# Altium schematic sheet 5_POWER.schdoc.schdoc
size 431 x 309 mm; Symbol: Sheet-Symbol_A4; Device: Sheet-Symbol_A4; Company: 嘉立创EDA; Version: V1.0; Page Size: A4; @Project Name: ProDocument_LN_CTRL_V1; @Page Count: 5; @Update Date: 2026-01-05; @Create Date: 2026-01-05; @Schematic Name: Schematic1; @Page No: 5; @Page Name: POWER
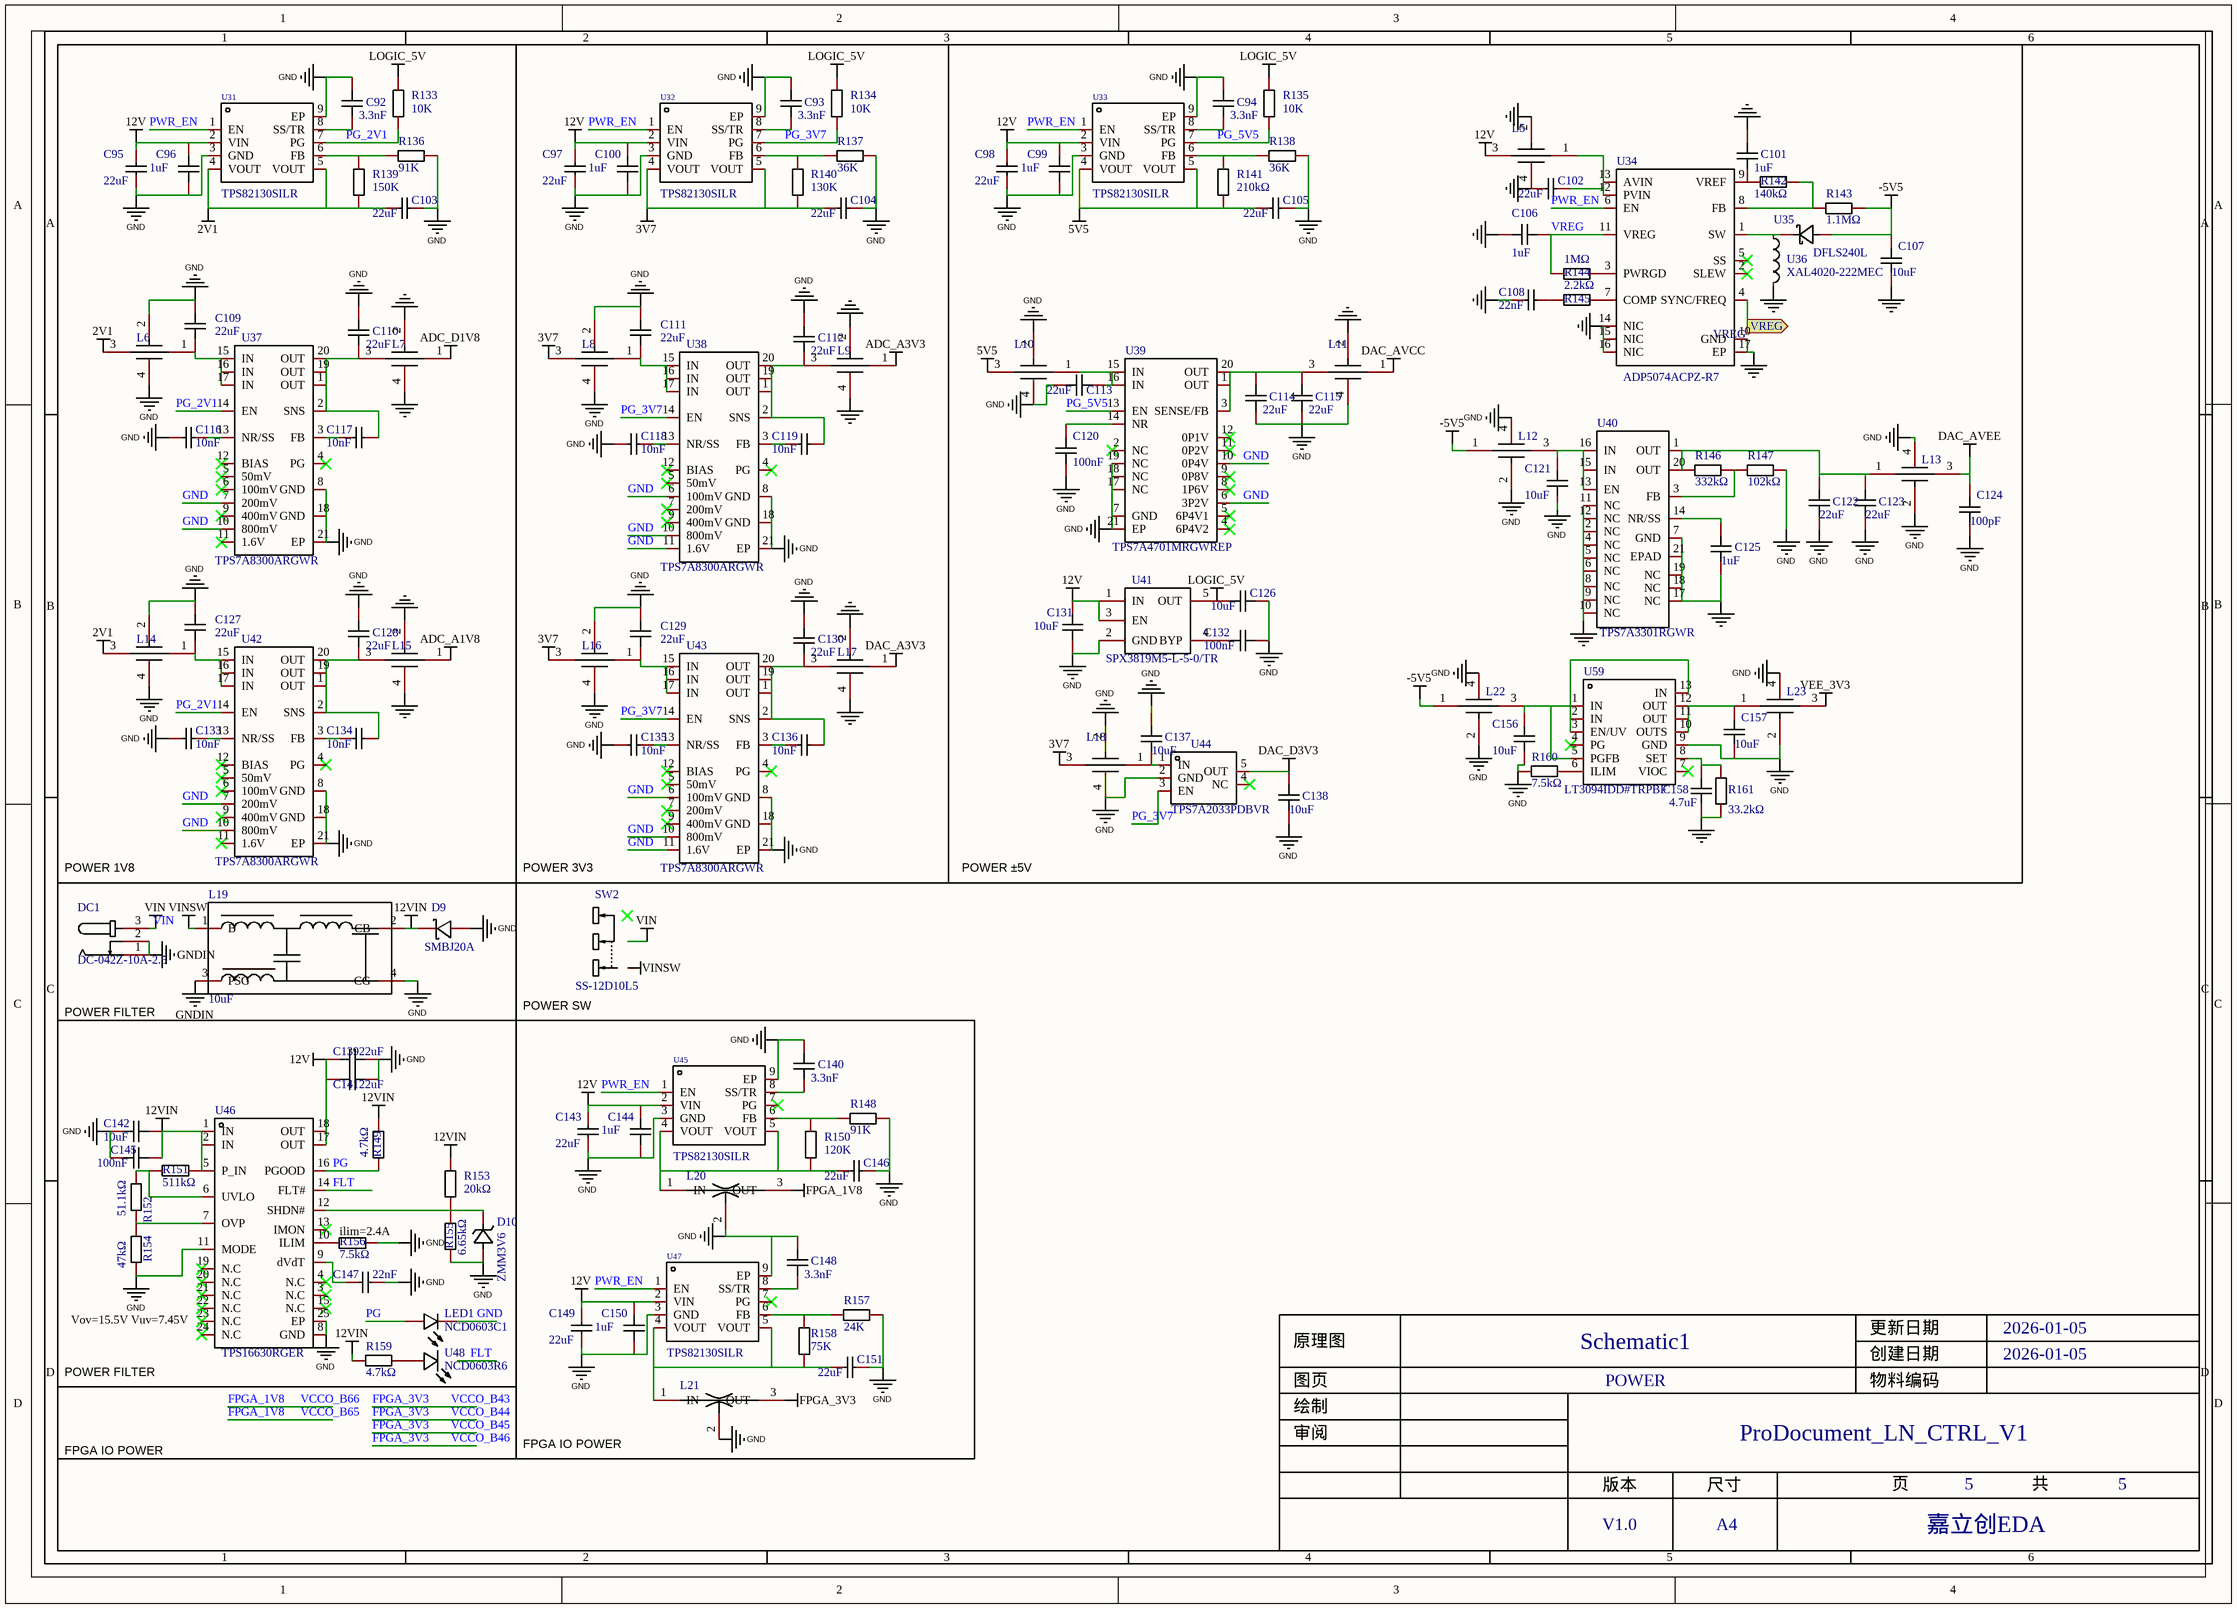
[diagram p0: 5_POWER.schdoc.schdoc]

## Parts
C92  3.3nF  [C0402]
C93  3.3nF  [C0402]
C94  3.3nF  [C0402]
C95  22uF  [C0805]
C96  1uF  [C0402]
C97  22uF  [C0805]
C98  22uF  [C0805]
C99  1uF  [C0402]
C100  1uF  [C0402]
C101  1uF  [C0603]
C102  22uF  [C0805]
C103  22uF  [C0805]
C104  22uF  [C0805]
C105  22uF  [C0805]
C106  1uF  [C0603]
C107  10uF  [C0603]
C108  22nF  [C0402]
C109  22uF  [C0805]
C110  22uF  [C0805]
C111  22uF  [C0805]
C112  22uF  [C0805]
C113  22uF  [C0805]
C114  22uF  [C0805]
C115  22uF  [C0805]
C116  10nF  [C0402]
C117  10nF  [C0402]
C118  10nF  [C0402]
C119  10nF  [C0402]
C120  100nF  [C0402]
C121  10uF  [C0603]
C122  22uF  [C0805]
C123  22uF  [C0805]
C124  100pF  [C0402]
C125  1uF  [C0603]
C126  10uF  [C0603]
C127  22uF  [C0805]
C128  22uF  [C0805]
C129  22uF  [C0805]
C130  22uF  [C0805]
C131  10uF  [C0603]
C132  100nF  [C0402]
C133  10nF  [C0402]
C134  10nF  [C0402]
C135  10nF  [C0402]
C136  10nF  [C0402]
C137  10uF  [C0603]
C138  10uF  [C0603]
C139  22uF  [C1206]
C140  3.3nF  [C0402]
C141  22uF  [C1206]
C142  10uF  [C0805]
C143  22uF  [C0805]
C144  1uF  [C0402]
C145  100nF  [C0402]
C146  22uF  [C0805]
C147  22nF  [C0402]
C148  3.3nF  [C0402]
C149  22uF  [C0805]
C150  1uF  [C0402]
C151  22uF  [C0805]
C156  10uF  [C0603]
C157  10uF  [C0603]
C158  4.7uF  [C0402]
D9  SMBJ20A  [SMB_L4.5-W3.7-LS5.4-RD]
D10  ZMM3V6  [LL-34_L3.5-W1.5-RD]
DC1  DC-042Z-10A-2.5  [DC-IN-TH_DC-042C-Z-2.5-A]
L5  NFM21PC104R1E3D  [CAP-SMD_4P-L2.0-W1.25]  (value not drawn)
L6  NFM21PC104R1E3D  [CAP-SMD_4P-L2.0-W1.25]  (value not drawn)
L7  NFM21PC104R1E3D  [CAP-SMD_4P-L2.0-W1.25]  (value not drawn)
L8  NFM21PC104R1E3D  [CAP-SMD_4P-L2.0-W1.25]  (value not drawn)
L9  NFM21PC104R1E3D  [CAP-SMD_4P-L2.0-W1.25]  (value not drawn)
L10  NFM21PC104R1E3D  [CAP-SMD_4P-L2.0-W1.25]  (value not drawn)
L11  NFM21PC104R1E3D  [CAP-SMD_4P-L2.0-W1.25]  (value not drawn)
L12  NFM21PC104R1E3D  [CAP-SMD_4P-L2.0-W1.25]  (value not drawn)
L13  NFM21PC104R1E3D  [CAP-SMD_4P-L2.0-W1.25]  (value not drawn)
L14  NFM21PC104R1E3D  [CAP-SMD_4P-L2.0-W1.25]  (value not drawn)
L15  NFM21PC104R1E3D  [CAP-SMD_4P-L2.0-W1.25]  (value not drawn)
L16  NFM21PC104R1E3D  [CAP-SMD_4P-L2.0-W1.25]  (value not drawn)
L17  NFM21PC104R1E3D  [CAP-SMD_4P-L2.0-W1.25]  (value not drawn)
L18  NFM21PC104R1E3D  [CAP-SMD_4P-L2.0-W1.25]  (value not drawn)
L19  10uF  [FILTER-SMD_BNX026H01L]
L20  NFM18PC105R0J3D  [FILTER-SMD_3P-L1.6-W0.8-L]  (value not drawn)
L21  NFM18PC105R0J3D  [FILTER-SMD_3P-L1.6-W0.8-L]  (value not drawn)
L22  NFM21PC104R1E3D  [CAP-SMD_4P-L2.0-W1.25]  (value not drawn)
L23  NFM21PC104R1E3D  [CAP-SMD_4P-L2.0-W1.25]  (value not drawn)
LED1  NCD0603C1  [LED0603-RD]
R133  10K  [R0402]
R134  10K  [R0402]
R135  10K  [R0402]
R136  91K  [R0402]
R137  36K  [R0402]
R138  36K  [R0402]
R139  150K  [R0402]
R140  130K  [R0402]
R141  210kΩ  [R0402]
R142  140kΩ  [R0402]
R143  1.1MΩ  [R0402]
R144  1MΩ  [R0402]
R145  2.2kΩ  [R0402]
R146  332kΩ  [R0402]
R147  102kΩ  [R0402]
R148  91K  [R0402]
R149  4.7kΩ  [R0402]
R150  120K  [R0402]
R151  511kΩ  [R0402]
R152  51.1kΩ  [R0402]
R153  20kΩ  [R0402]
R154  47kΩ  [R0402]
R155  6.65kΩ  [R0402]
R156  7.5kΩ  [R0402]
R157  24K  [R0402]
R158  75K  [R0402]
R159  4.7kΩ  [R0402]
R160  7.5kΩ  [R0402]
R161  33.2kΩ  [R0402]
SW2  SS-12D10L5  [SW-TH_SS-12D10L5]
U31  TPS82130SILR  [USIP-8_L3.0-W2.8-P0.65-TL-EP]
U32  TPS82130SILR  [USIP-8_L3.0-W2.8-P0.65-TL-EP]
U33  TPS82130SILR  [USIP-8_L3.0-W2.8-P0.65-TL-EP]
U34  ADP5074ACPZ-R7  [LFCSP-16_L3.0-W3.0-P0.50-BL-EP1.7]
U35  DFLS240L  [POWERDI-123_L2.8-W1.8-LS3.7-RD]
U36  XAL4020-222MEC  [IND-SMD_L4.0-W4.0-A]
U37  TPS7A8300ARGWR  [VQFN-20_L5.0-W5.0-P0.65-TL-EP3.2]
U38  TPS7A8300ARGWR  [VQFN-20_L5.0-W5.0-P0.65-TL-EP3.2]
U39  TPS7A4701MRGWREP  [VQFN-20_L5.0-W5.0-P0.65-TL-EP3.2]
U40  TPS7A3301RGWR  [VQFN-20_L5.0-W5.0-P0.65-TL-EP]
U41  SPX3819M5-L-5-0/TR  [SOT-23-5_L3.0-W1.7-P0.95-LS2.8-BL]
U42  TPS7A8300ARGWR  [VQFN-20_L5.0-W5.0-P0.65-TL-EP3.2]
U43  TPS7A8300ARGWR  [VQFN-20_L5.0-W5.0-P0.65-TL-EP3.2]
U44  TPS7A2033PDBVR  [SOT-23-5_L2.9-W1.6-P0.95-LS2.8-BR]
U45  TPS82130SILR  [USIP-8_L3.0-W2.8-P0.65-TL-EP]
U46  TPS16630RGER  [VFQFPN-24_L4.0-W4.0-P0.50-BL-EP2.8]
U47  TPS82130SILR  [USIP-8_L3.0-W2.8-P0.65-TL-EP]
U48  NCD0603R6  [LED0603-RD]
U59  LT3094IDD#TRPBF  [DFN-12_L3.0-W3.0-P0.45-BL-EP-1]

## Blocks framed on the sheet
POWER 1V8: C92 C95 C96 C103 C109 C110 C116 C117 C127 C128 C133 C134 L6 L7 L14 L15 R133 R136 R139 U31 U37 U42
POWER 3V3: C93 C97 C100 C104 C111 C112 C118 C119 C129 C130 C135 C136 L8 L9 L16 L17 R134 R137 R140 U32 U38 U43
POWER ±5V: C94 C98 C99 C101 C102 C105-C108 C113-C115 C120-C126 C131 C132 C137 C138 C156-C158 L5 L10-L13 L18 L22 L23 R135 R138 R141-R147 R160 R161 U33-U36 U39-U41 U44 U59

## Ports
VREG (out)

## Nets
2V1: C103.2 L6.3(OUT) L14.3(OUT) R139.1 U31.4(VOUT) U31.5(VOUT)
3V7: C104.2 L8.3(OUT) L16.3(OUT) L18.3(OUT) R140.1 U32.4(VOUT) U32.5(VOUT)
5V5: C105.2 L10.3(OUT) R141.1 U33.4(VOUT) U33.5(VOUT)
12V: C95.2 C96.1 C97.2 C98.2 C99.1 C100.1 C131.2 C139.1 C141.1 C143.2 C144.1 C149.2 C150.1 L5.3(OUT) U31.2(VIN) U32.2(VIN) U33.2(VIN) U41.1(IN) U41.3(EN) U45.2(VIN) U46.17(OUT) U46.18(OUT) U47.2(VIN)
12VIN: C142.2 C145.2 D9.1(K) L19.2(CB) R149.2 R151.2 R153.2 R159.2 U46.1(IN) U46.2(IN) U46.5(P_IN)
-5V5: C107.2 L12.1(IN) L22.1(IN) R143.2 U35.2(A)
ADC_A1V8: L15.1(IN)
ADC_A3V3: L9.1(IN)
ADC_D1V8: L7.1(IN)
DAC_A3V3: L17.1(IN)
DAC_AVCC: L11.1(IN)
DAC_AVEE: C124.2 L13.3(OUT)
DAC_D3V3: C138.2 U44.5(OUT)
FPGA_1V8: L20.3(OUT)  [also labelled VCCO_B65, VCCO_B66]
FPGA_3V3: L21.3(OUT)  [also labelled VCCO_B43, VCCO_B44, VCCO_B45, VCCO_B46]
GND: C92.2 C93.2 C94.2 C95.1 C96.2 C97.1 C98.1 C99.2 C100.2 C101.2 C102.1 C103.1 C104.1 C105.1 C106.1 C107.1 C108.1 C109.1 C110.2 C111.1 C112.2 C113.2 C114.1 C115.1 C116.1 C118.1 C120.1 C121.1 C122.2 C123.2 C124.1 C125.1 C126.1 C127.1 C128.2 C129.1 C130.2 C131.1 C132.1 C133.1 C135.1 C137.2 C138.1 C139.2 C140.2 C141.2 C142.1 C143.1 C144.2 C145.1 C146.1 C147.2 C148.2 C149.1 C150.2 C151.1 C156.1 C157.1 C158.1 D9.2(A) D10.2(A) L5.2(GND) L5.4(GND) L6.2(GND) L6.4(GND) L7.2(GND) L7.4(GND) L8.2(GND) L8.4(GND) L9.2(GND) L9.4(GND) L10.2(GND) L10.4(GND) L11.2(GND) L11.4(GND) L12.2(GND) L12.4(GND) L13.2(GND) L13.4(GND) L14.2(GND) L14.4(GND) L15.2(GND) L15.4(GND) L16.2(GND) L16.4(GND) L17.2(GND) L17.4(GND) L18.2(GND) L18.4(GND) L19.4(CG) L20.2(GND) L21.2(GND) L22.2(GND) L22.4(GND) L23.2(GND) L23.4(GND) LED1.1(-) R136.2 R137.2 R138.2 R147.2 R148.2 R154.2 R155.1 R156.2 R157.2 R160.1 R161.1 U31.3(GND) U31.9(EP) U32.3(GND) U32.9(EP) U33.3(GND) U33.9(EP) U34.10(GND) U34.14(NIC) U34.15(NIC) U34.16(NIC) U34.17(EP) U36.2 U37.7(200mV) U37.8(GND) U37.10(800mV) U37.18(GND) U37.21(EP) U38.6(100mV) U38.8(GND) U38.10(800mV) U38.11(1.6V) U38.18(GND) U38.21(EP) U39.6(3P2V) U39.7(GND) U39.10(0P4V) U39.17(NC) U39.18(NC) U39.19(NC) U39.21(EP) U40.2(NC) U40.4(NC) U40.5(NC) U40.6(NC) U40.7(GND) U40.8(NC) U40.9(NC) U40.10(NC) U40.11(NC) U40.12(NC) U40.17(NC) U40.18(NC) U40.19(NC) U40.21(EPAD) U41.2(GND) U42.7(200mV) U42.8(GND) U42.10(800mV) U42.18(GND) U42.21(EP) U43.6(100mV) U43.8(GND) U43.10(800mV) U43.11(1.6V) U43.18(GND) U43.21(EP) U44.2(GND) U45.3(GND) U45.9(EP) U46.8(GND) U46.11(MODE) U46.25(EP) U47.3(GND) U47.9(EP) U59.9(GND)
GNDIN: DC1.1 DC1.2 L19.3(PSG)
LOGIC_5V: C126.2 R133.1 R134.1 R135.1 U41.5(OUT)
VEE_3V3: L23.3(OUT)
VIN: DC1.3
VINSW: L19.1(B)
FLT: U46.14(FLT#)
PG: LED1.2(+) R149.1 U46.16(PGOOD)
PG_2V1: R133.2 U31.7(PG) U37.14(EN) U42.14(EN)
PG_3V7: R134.2 U32.7(PG) U38.14(EN) U43.14(EN) U44.3(EN)
PG_5V5: R135.2 U33.7(PG) U39.13(EN)
PWR_EN: U31.1(EN) U32.1(EN) U33.1(EN) U34.6(EN) U45.1(EN) U47.1(EN)
VREG: C106.2 R144.2 U34.4(SYNC/FREQ) U34.11(VREG) ; port VREG
NetC92_1: C92.1 U31.8(SS/TR)
NetC93_1: C93.1 U32.8(SS/TR)
NetC94_1: C94.1 U33.8(SS/TR)
NetC101_1: C101.1 R142.2 U34.9(VREF)
NetC102_2: C102.2 L5.1(IN) U34.12(PVIN) U34.13(AVIN)
NetC108_2: C108.2 R145.1
NetC109_2: C109.2 L6.1(IN) U37.15(IN) U37.16(IN) U37.17(IN)
NetC110_1: C110.1 C117.2 L7.3(OUT) U37.1(OUT) U37.2(SNS) U37.19(OUT) U37.20(OUT)
NetC111_2: C111.2 L8.1(IN) U38.15(IN) U38.16(IN) U38.17(IN)
NetC112_1: C112.1 C119.2 L9.3(OUT) U38.1(OUT) U38.2(SNS) U38.19(OUT) U38.20(OUT)
NetC113_1: C113.1 L10.1(IN) U39.15(IN) U39.16(IN)
NetC114_2: C114.2 C115.2 L11.3(OUT) U39.1(OUT) U39.3(SENSE/FB) U39.20(OUT)
NetC116_2: C116.2 U37.13(NR/SS)
NetC117_1: C117.1 U37.3(FB)
NetC118_2: C118.2 U38.13(NR/SS)
NetC119_1: C119.1 U38.3(FB)
NetC120_2: C120.2 U39.14(NR)
NetC121_2: C121.2 L12.3(OUT) U40.13(EN) U40.15(IN) U40.16(IN)
NetC122_1: C122.1 C123.1 L13.1(IN) R146.2 U40.1(OUT) U40.20(OUT)
NetC125_2: C125.2 U40.14(NR/SS)
NetC127_2: C127.2 L14.1(IN) U42.15(IN) U42.16(IN) U42.17(IN)
NetC128_1: C128.1 C134.2 L15.3(OUT) U42.1(OUT) U42.2(SNS) U42.19(OUT) U42.20(OUT)
NetC129_2: C129.2 L16.1(IN) U43.15(IN) U43.16(IN) U43.17(IN)
NetC130_1: C130.1 C136.2 L17.3(OUT) U43.1(OUT) U43.2(SNS) U43.19(OUT) U43.20(OUT)
NetC132_2: C132.2 U41.4(BYP)
NetC133_2: C133.2 U42.13(NR/SS)
NetC134_1: C134.1 U42.3(FB)
NetC135_2: C135.2 U43.13(NR/SS)
NetC136_1: C136.1 U43.3(FB)
NetC137_1: C137.1 L18.1(IN) U44.1(IN)
NetC140_1: C140.1 U45.8(SS/TR)
NetC146_2: C146.2 L20.1(IN) R150.1 U45.4(VOUT) U45.5(VOUT)
NetC147_1: C147.1 U46.9(dVdT)
NetC148_1: C148.1 U47.8(SS/TR)
NetC151_2: C151.2 L21.1(IN) R158.1 U47.4(VOUT) U47.5(VOUT)
NetC156_2: C156.2 L22.3(OUT) U59.1(IN) U59.2(IN) U59.3(EN/UV) U59.5(PGFB) U59.13(IN)
NetC157_2: C157.2 L23.1(IN) U59.10(OUTS) U59.11(OUT) U59.12(OUT)
NetC158_2: C158.2 R161.2 U59.8(SET)
NetD10_1: D10.1(K) R153.1 R155.2 U46.12(SHDN#)
NetR136_1: R136.1 R139.2 U31.6(FB)
NetR137_1: R137.1 R140.2 U32.6(FB)
NetR138_1: R138.1 R141.2 U33.6(FB)
NetR142_1: R142.1 R143.1 U34.8(FB)
NetR144_1: R144.1 U34.3(PWRGD)
NetR145_2: R145.2 U34.7(COMP)
NetR146_1: R146.1 R147.1 U40.3(FB)
NetR148_1: R148.1 R150.2 U45.6(FB)
NetR151_1: R151.1 R152.2 U46.6(UVLO)
NetR152_1: R152.1 R154.1 U46.7(OVP)
NetR156_1: R156.1 U46.10(ILIM)
NetR157_1: R157.1 R158.2 U47.6(FB)
NetR159_1: R159.1 U48.2(+)
NetR160_2: R160.2 U59.6(ILIM)
NetU34_1: U34.1(SW) U35.1(C) U36.1

Not connected (* = marked no-connect by the designer): SW2 1 2 3; U34 2(SLEW)* 5(SS)*; U37 4(PG)* 5(50mV)* 6(100mV)* 9(400mV)* 11(1.6V)* 12(BIAS)*; U38 4(PG)* 5(50mV)* 7(200mV)* 9(400mV)* 12(BIAS)*; U39 2(NC)* 4(6P4V2)* 5(6P4V1)* 8(1P6V)* 9(0P8V)* 11(0P2V)* 12(0P1V)*; U42 4(PG)* 5(50mV)* 6(100mV)* 9(400mV)* 11(1.6V)* 12(BIAS)*; U43 4(PG)* 5(50mV)* 7(200mV)* 9(400mV)* 12(BIAS)*; U44 4(NC)*; U45 7(PG)*; U46 3(N.C)* 4(N.C)* 13(IMON)* 15(N.C)* 19(N.C)* 20(N.C)* 21(N.C)* 22(N.C)* 23(N.C)* 24(N.C)*; U47 7(PG)*; U48 1(-); U59 4(PG)* 7(VIOC)*

## Notes on the sheet
- POWER FILTER
- POWER SW
- (near R156) ilim=2.4A
- (near U46) Vov=15.5V Vuv=7.45V
- FPGA IO POWER
- 1
- 2
- 3
- 4
- 5
- 6
- A
- B
- C
- D
- 原理图
- Schematic1
- 创建日期
- 更新日期
- 2026-01-05
- 审阅
- 绘制
- 图页
- POWER
- 物料编码
- ProDocument_LN_CTRL_V1
- 版本
- 尺寸
- 页
- 共
- V1.0
- A4
- 嘉立创EDA

## Library data of the parts
C92-C94 C124 C140 C148 = CAP_0402: Symbol: CapAcitance; Convert to PCB: yes; Device: CAP_0402; Add into BOM: yes; Supplier Footprint: 0402
  C92-C94 C140 C148: Name: 3.3nF; Value: 3.3nF
  C124: Name: 100pF; Value: 100pF
C95 C97 C98 C102-C105 C143 C146 C149 C151 = GRM21BR61E226ME44L: Manufacturer: muRata(村田); Add into BOM: yes; Tolerance: ±20%; Voltage Rating: 25V; Temperature Coefficient: X5R; Description: 容值:22uF;精度:±20%;额定电压:25V;温度系数:X5R;; Name: 22uF; Symbol: GRM21BR61E226ME44L; Device: GRM21BR61E226ME44L; LCSC Part Name: 22uF ±20% 25V; Supplier Part: C86816; Manufacturer Part: GRM21BR61E226ME44L; Supplier Footprint: 0805; JLCPCB Part Class: 扩展库; Datasheet: https://item.szlcsc.com/datasheet/GRM21BR61E226ME44L/87993.html; Supplier: LCSC; Convert to PCB: yes; Value: 22uF
C96 C99 C100 C144 C150 = CL05X105KA5NQNC: Manufacturer: SAMSUNG(三星); Symbol: CapAcitance; Add into BOM: yes; Tolerance: ±10%; Voltage Rated: 25V; Temperature Coefficient: X6S; Description: 容值:1uF;精度:±10%;额定电压:25V;材质(温度系数):X6S;; Name: 1uF; Device: CL05X105KA5NQNC; LCSC Part Name: 1uF ±10% 25V; Supplier Part: C307454; Manufacturer Part: CL05X105KA5NQNC; Supplier Footprint: 0402; JLCPCB Part Class: Extended Part; Datasheet: https://atta.szlcsc.com/upload/public/pdf/source/20160218/1457707763339.pdf; Supplier: LCSC; Convert to PCB: yes; Value: 1uF
C101 C106 C125 = GCM188R71E105KA64D: Manufacturer: muRata(村田); Add into BOM: yes; Tolerance: ±10%; Voltage Rating: 25V; Temperature Coefficient: X7R; Description: 容值:1uF;精度:±10%;额定电压:25V;温度系数:X7R;; Name: 1uF; Symbol: GCM188R71E105KA64D; Device: GCM188R71E105KA64D; LCSC Part Name: 1uF ±10% 25V; Supplier Part: C85862; Manufacturer Part: GCM188R71E105KA64D; Supplier Footprint: 0603; JLCPCB Part Class: 扩展库; Datasheet: https://item.szlcsc.com/datasheet/GCM188R71E105KA64D/87038.html; Supplier: LCSC; Convert to PCB: yes; Value: 1uF
C107 C121 C137 C138 C156 C157 = GRM188Z71A106KA73D: Manufacturer: muRata(村田); Add into BOM: yes; Tolerance: ±10%; Voltage Rated: 10V; Temperature Coefficient: X7R; Description: 容值:10uF;精度:±10%;额定电压:10V;材质(温度系数):X7R;; Name: 10uF; Symbol: GRM188Z71A106KA73D; Device: GRM188Z71A106KA73D; LCSC Part Name: 10uF ±10% 10V; Supplier Part: C2959727; Manufacturer Part: GRM188Z71A106KA73D; Supplier Footprint: 0603; JLCPCB Part Class: 扩展库; Datasheet: https://atta.szlcsc.com/upload/public/pdf/source/20220328/6A4892B7E841253269A84FFE395E0578.pdf; Supplier: LCSC; Convert to PCB: yes; Value: 10uF
C108 C147 = GRM155R71H223KA12D: Manufacturer: muRata(村田); Add into BOM: yes; Tolerance: ±10%; Voltage Rated: 50V; Temperature Coefficient: X7R; Description: 容值:22nF;精度:±10%;额定电压:50V;材质(温度系数):X7R;; Name: 22nF; Symbol: GRM155R71H223KA12D; Device: GRM155R71H223KA12D; LCSC Part Name: 22nF ±10% 50V; Supplier Part: C77023; Manufacturer Part: GRM155R71H223KA12D; Supplier Footprint: 0402; JLCPCB Part Class: 扩展库; Datasheet: https://atta.szlcsc.com/upload/public/pdf/source/20180326/C77023_485AB0D0559A254D360F85D8E7719291.pdf; Supplier: LCSC; Convert to PCB: yes; Value: 22nF
C109-C112 C127-C130 = CL21A226MAQNNNE_C45783: Manufacturer: SAMSUNG(三星); Add into BOM: yes; Tolerance: ±20%; Voltage Rated: 25V; Temperature Coefficient: X5R; Description: 容值:22uF;精度:±20%;额定电压:25V;材质(温度系数):X5R;; Name: 22uF; Symbol: CL21A226MAQNNNE; Device: CL21A226MAQNNNE_C45783; LCSC Part Name: 22uF ±20% 25V; Supplier Part: C45783; Manufacturer Part: CL21A226MAQNNNE; Supplier Footprint: 0805; JLCPCB Part Class: 基础库; Datasheet: https://atta.szlcsc.com/upload/public/pdf/source/20160103/1457707727161.pdf; Supplier: LCSC; Convert to PCB: yes; Value: 22uF
C113-C115 = GRM21BC81C226ME44L: Manufacturer: muRata(村田); Add into BOM: yes; Tolerance: ±20%; Voltage Rated: 16V; Temperature Coefficient: X6S; Description: 容值:22uF;精度:±20%;额定电压:16V;材质(温度系数):X6S;; Name: 22uF; Symbol: GRM21BC81C226ME44L; Device: GRM21BC81C226ME44L; LCSC Part Name: 22uF ±20% 16V; Supplier Part: C258782; Manufacturer Part: GRM21BC81C226ME44L; Supplier Footprint: 0805; JLCPCB Part Class: 扩展库; Datasheet: https://atta.szlcsc.com/upload/public/pdf/source/20200117/C258782_354729B55DBAD136BAA783E298FE5367.pdf; Supplier: LCSC; Convert to PCB: yes; Value: 22uF
C116-C119 C133-C136 = CL05B103KB5NNNC: Manufacturer: SAMSUNG(三星); Add into BOM: yes; Tolerance: ±10%; Voltage Rated: 50V; Temperature Coefficient: X7R; Description: 容值:10nF;精度:±10%;额定电压:50V;材质(温度系数):X7R;; Name: 10nF; Symbol: CL05B103KB5NNNC; Device: CL05B103KB5NNNC; LCSC Part Name: 10nF ±10% 50V; Supplier Part: C15195; Manufacturer Part: CL05B103KB5NNNC; Supplier Footprint: 0402; JLCPCB Part Class: 基础库; Datasheet: https://atta.szlcsc.com/upload/public/pdf/source/20160218/1457707763339.pdf; Supplier: LCSC; Convert to PCB: yes; Value: 10nF
C120 C132 C145 = GRM155R71H104KE14D: Manufacturer: muRata(村田); Add into BOM: yes; Tolerance: ±10%; Voltage Rated: 50V; Temperature Coefficient: X7R; Description: 容值:100nF;精度:±10%;额定电压:50V;材质(温度系数):X7R;; Name: 100nF; Symbol: GRM155R71H104KE14D; Device: GRM155R71H104KE14D; LCSC Part Name: 100nF ±10% 50V; Supplier Part: C77020; Manufacturer Part: GRM155R71H104KE14D; Supplier Footprint: 0402; JLCPCB Part Class: 扩展库; Datasheet: https://atta.szlcsc.com/upload/public/pdf/source/20180326/C77020_39BD49C951FF1AF0DB1F1FAC5AC1E401.pdf; Supplier: LCSC; Convert to PCB: yes; Value: 100nF
C122 C123 = CAP_0805: Symbol: CapAcitance; Convert to PCB: yes; Name: 22uF; Device: CAP_0805; Add into BOM: yes; Supplier Footprint: 0805; Value: 22uF
C126 C131 = CAP_0603: Symbol: CapAcitance; Convert to PCB: yes; Name: 10uF; Device: CAP_0603; Add into BOM: yes; Supplier Footprint: 0603; Value: 10uF
C139 C141 = CGA1206X5R226M350NT: Manufacturer: HRE(芯声); Add into BOM: yes; Tolerance: ±20%; Voltage Rated: 35V; Temperature Coefficient: X5R; Description: 容值:22uF;精度:±20%;额定电压:35V;材质(温度系数):X5R;; Name: 22uF; Symbol: CGA1206X5R226M350NT; Device: CGA1206X5R226M350NT; LCSC Part Name: 22uF ±20% 35V; Supplier Part: C6119969; Manufacturer Part: CGA1206X5R226M350NT; Supplier Footprint: 1206; JLCPCB Part Class: 扩展库; Supplier: LCSC; Convert to PCB: yes; Value: 22uF
C142 = GRM21BR61H106KE43L: Manufacturer: muRata(村田); Add into BOM: yes; Tolerance: ±10%; Voltage Rated: 50V; Temperature Coefficient: X5R; Description: 容值:10uF;精度:±10%;额定电压:50V;材质(温度系数):X5R;; Name: 10uF; Symbol: GRM21BR61H106KE43L; Device: GRM21BR61H106KE43L; Supplier: LCSC; Supplier Part: C440198; Manufacturer Part: GRM21BR61H106KE43L; Value: 10uF; JLCPCB Part Class: 基础库; LCSC Part Name: 10uF ±10% 50V; Supplier Footprint: 0805; Datasheet: https://atta.szlcsc.com/upload/public/pdf/source/20230811/95AAE0C9AF55EDC31B7A4D8B733F534E.pdf; Convert to PCB: yes
C158 = GRM155R61E475ME15D: Manufacturer: muRata(村田); Add into BOM: yes; Tolerance: ±20%; Voltage Rating: 25V; Temperature Coefficient: X5R; Description: 容值:4.7uF;精度:±20%;额定电压:25V;温度系数:X5R;; Name: 4.7uF; Symbol: GRM155R61E475ME15D; Device: GRM155R61E475ME15D; LCSC Part Name: 4.7uF ±20% 25V; Supplier Part: C2858031; Manufacturer Part: GRM155R61E475ME15D; Supplier Footprint: 0402; JLCPCB Part Class: 扩展库; Datasheet: https://item.szlcsc.com/datasheet/GRM155R61E475ME15D/3058877.html; Supplier: LCSC; Convert to PCB: yes; Value: 4.7uF
D9 = SMBJ20A_C151922: Manufacturer: BORN(伯恩半导体); Add into BOM: yes; Reverse Stand-Off Voltage (Vrwm): 20V; Maximum Clamping Voltage: 32.4V; Peak Pulse Current (Ipp)@10/1000us: 18.6A; Breakdown Voltage: 22.2V; Type: TVS; Description: 反向截止电压(Vrwm):20V;最大钳位电压:32.4V;峰值脉冲电流(Ipp)@10/1000us:18.6A;击穿电压:22.2V;; Name: SMBJ20A; Symbol: SMBJ20A_C151922; Device: SMBJ20A_C151922; Supplier: LCSC; Supplier Part: C151922; Manufacturer Part: SMBJ20A; JLCPCB Part Class: 扩展库; LCSC Part Name: SMBJ20A; Supplier Footprint: SMB; Datasheet: https://atta.szlcsc.com/upload/public/pdf/source/20200413/C152089_47B9F2142CBB08C8573970559A15E9B6.pdf; Convert to PCB: yes
D10 = ZMM3V6_1: Manufacturer: HXY MOSFET(华轩阳电子); Symbol: ZMM3V6_C5345988; Add into BOM: yes; Diode Configuration: 独立式; Zener Voltage (Nom): 3.6V; Reverse Leakage Current (Ir): 2uA@1V; Zener Voltage (Range): 3.4V~3.8V; Power Dissipation: 500mW; Zener Impedance (Zzt): 85Ω; Description: 二极管配置:独立式;稳压值(标称值):3.6V;稳压值(范围):3.4V~3.8V;功率(Pd):500mW;; Name: ZMM3V6; Device: ZMM3V6_1; LCSC Part Name: ZMM3V6; Supplier Part: C5345988; Manufacturer Part: ZMM3V6; Supplier Footprint: LL-34; JLCPCB Part Class: 扩展库; Datasheet: https://atta.szlcsc.com/upload/public/pdf/source/20240618/16C526453F44576F0942DF21C8FF248D.pdf; Supplier: LCSC; Convert to PCB: yes
DC1 = DC-042Z-10A-2.5: Manufacturer: XKB Connection(中国星坤); Symbol: DC-042C-Z-2.5-A; Add into BOM: yes; Connector Type: DC电源插座; Inside Contact Diameter: 2.5mm; Outside Contact Diameter: 6mm; Current Rating: 10A; Voltage Rating (Max): 20V; Description: 连接器类型:DC电源插座;安装方式:弯插;触点内径:2.5mm;触点外径:6mm;额定电流:10A;额定电压:20V;工作温度:-20℃~+70℃;; Name: DC-042Z-10A-2.5; Device: DC-042Z-10A-2.5; LCSC Part Name: 不带开关 DC电源插座 内径:2.5mm 外径:6mm; Supplier Part: C706901; Manufacturer Part: DC-042Z-10A-2.5; Supplier Footprint: 插件; JLCPCB Part Class: 扩展库; Datasheet: https://item.szlcsc.com/datasheet/DC-042Z-10A-2.5/744023.html; Supplier: LCSC; Convert to PCB: yes; Mounting Type: 弯插; Operating Temperature: -20℃~+70℃
L5-L18 L22 L23 = NFM21PC104R1E3D: Manufacturer: muRata(村田); Add into BOM: yes; Nominal Capacitance: 100nF; CapacitanceTolerance: ±20%; DC Rated Voltage: 25V; Rated Current: 2A; DC Resistance: 30mΩ; Description: 电容量:100nF;精度:±20%;直流电阻:30mΩ;; Name: NFM21PC104R1E3D; Symbol: NFM21PC104R1E3D; Device: NFM21PC104R1E3D; LCSC Part Name: 100nF(104) ±20% 25V; Supplier Part: C86150; Manufacturer Part: NFM21PC104R1E3D; Supplier Footprint: 0805; JLCPCB Part Class: 扩展库; Datasheet: https://atta.szlcsc.com/upload/public/pdf/source/20180326/C86150_E4B7366323682FA84DED9003C68CA797.pdf; Supplier: LCSC; Convert to PCB: yes; Operating Temperature: -55℃~+125℃
L19 = BNX026H01L: Manufacturer: muRata(村田); Add into BOM: yes; Voltage Rating: 50V; Current Rating: 20A; Filter Order: 5; ESD Protection: 无; Number of Channels: 2; Attenuation Value: 35dB@50kHz~1GHz; Description: 滤波器阶数:5;阻值:0.43mΩ;容值:10uF;通道数:2;; Name: 10uF; Symbol: BNX026H01L; Device: BNX026H01L; LCSC Part Name: BNX026H01L; Supplier Part: C80505; Manufacturer Part: BNX026H01L; Supplier Footprint: SMD-4P,12.1x9.1mm; JLCPCB Part Class: 扩展库; Datasheet: https://item.szlcsc.com/datasheet/BNX026H01L/81651.html; Supplier: LCSC; Convert to PCB: yes; Value: 10uF; Operating Temperature: -55℃~+125℃
L20 L21 = NFM18PC105R0J3D: Manufacturer: muRata(村田); Add into BOM: yes; Nominal Capacitance: 1uF; CapacitanceTolerance: ±20%; DC Rated Voltage: 6.3V; Rated Current: 4A; DC Resistance: 10mΩ; Description: 电容量:1uF;精度:±20%;直流电阻:10mΩ;; Name: NFM18PC105R0J3D; Symbol: NFM18PC105R0J3D; Device: NFM18PC105R0J3D; LCSC Part Name: 1uF(105) ±20% 6.3V; Supplier Part: C98103; Manufacturer Part: NFM18PC105R0J3D; Supplier Footprint: SMD-3P,0.8x1.6mm; JLCPCB Part Class: Extended Part; Datasheet: https://atta.szlcsc.com/upload/public/pdf/source/20180326/C98103_AFDAA7B32FFEB0E0991B58DAC44FEBA2.pdf; Supplier: LCSC; Convert to PCB: yes; Operating Temperature: -55℃~+105℃
LED1 = NCD0603C1: Manufacturer: 国星光电; Symbol: FC-D1608HGK-572C; Add into BOM: yes; Illumination Color: 黄绿色; Voltage - Forward(Vf): 1.6V~2.6V; Power(Watts): 65mW; Forward Current: 25mA; Wavelength - Dominant: 565nm~578nm; Peak Wavelength: 576nm; Luminous Intensity: 13mcd; Viewing Angle: 140°; Description: 灯头类型:-;发光颜色:黄绿色;正向压降(Vf):1.6V~2.6V;功率:65mW;正向电流:25mA;波长:565nm~578nm;二极管配置:-;透镜颜色:-;色温:-;发光强度:13mcd;发光角度:140°;载带方式:-;工作温度:-30℃~+85℃;; Name: NCD0603C1; Device: NCD0603C1; LCSC Part Name: 片式发光二极管; Supplier Part: C84264; Manufacturer Part: NCD0603C1; Supplier Footprint: 0603; JLCPCB Part Class: 扩展库; Datasheet: https://item.szlcsc.com/datasheet/NCD0603C1/85433.html; Supplier: LCSC; Convert to PCB: yes; Lamp Holder Type: -; Diode Configuration: -; Lens Color: -; Color Temperature: -; Mounting Style: -; Operating Temperature: -30℃~+85℃
R133-R140 R148 R150 R157 R158 = Res_0402: Symbol: 电阻; Convert to PCB: yes; Device: Res_0402; Add into BOM: yes; Supplier Footprint: 0402
  R133-R135: Name: 10K; Value: 10K
  R136 R148: Name: 91K; Value: 91K
  R137 R138: Name: 36K; Value: 36K
  R139: Name: 150K; Value: 150K
  R140: Name: 130K; Value: 130K
  R150: Name: 120K; Value: 120K
  R157: Name: 24K; Value: 24K
  R158: Name: 75K; Value: 75K
R141 = RC0402FR-07210KL: Manufacturer: YAGEO(国巨); Add into BOM: yes; Tolerance: ±1%; Power(Watts): 62.5mW; Overload Voltage (Max): 50V; Temperature Coefficient: ±100ppm/℃; Description: 电阻类型:厚膜电阻;阻值:210kΩ;精度:±1%;功率:62.5mW;最大工作电压:50V;温度系数:±100ppm/℃;; Name: 210kΩ; Symbol: RC0402FR-07210KL; Device: RC0402FR-07210KL; LCSC Part Name: 厚膜电阻 210kΩ ±1% 62.5mW; Supplier Part: C273331; Manufacturer Part: RC0402FR-07210KL; Supplier Footprint: 0402; JLCPCB Part Class: 扩展库; Datasheet: https://atta.szlcsc.com/upload/public/pdf/source/20180821/C275644_0D56F95EFF785E7D9A1FEF436B37DA78.pdf; Supplier: LCSC; Convert to PCB: yes; Type: 厚膜电阻; Value: 210kΩ; Operating Temperature Range: -55℃~+155℃
R142 = 0402WGF1403TCE: Manufacturer: UNI-ROYAL(厚声); Add into BOM: yes; Tolerance: ±1%; Power(Watts): 62.5mW; Overload Voltage (Max): 50V; Temperature Coefficient: ±100ppm/℃; Description: 电阻类型:厚膜电阻;阻值:140kΩ;精度:±1%;功率:62.5mW;最大工作电压:50V;温度系数:±100ppm/℃;; Name: 140kΩ; Symbol: 0402WGF1403TCE; Device: 0402WGF1403TCE; LCSC Part Name: 140kΩ ±1% 62.5mW 厚膜电阻; Supplier Part: C270645; Manufacturer Part: 0402WGF1403TCE; Supplier Footprint: 0402; JLCPCB Part Class: 扩展库; Datasheet: https://atta.szlcsc.com/upload/public/pdf/source/20200306/C422600_1E6D84923E4A46A82E41ADD87F860B5C.pdf; Supplier: LCSC; Convert to PCB: yes; Type: 厚膜电阻; Value: 140kΩ; Operating Temperature Range: -55℃~+155℃
R143 = 0402WGF1104TCE: Manufacturer: UNI-ROYAL(厚声); Add into BOM: yes; Tolerance: ±1%; Power(Watts): 62.5mW; Voltage-Supply(Max): 50V; Temperature Coefficient: ±100ppm/℃; Description: 电阻类型:厚膜电阻;阻值:1.1MΩ;精度:±1%;功率:62.5mW;工作电压:50V;温度系数:±100ppm/℃;; Name: 1.1MΩ; Symbol: 0402WGF1104TCE; Device: 0402WGF1104TCE; LCSC Part Name: 1.1MΩ ±1% 62.5mW 厚膜电阻; Supplier Part: C133039; Manufacturer Part: 0402WGF1104TCE; Supplier Footprint: 0402; JLCPCB Part Class: 扩展库; Datasheet: https://item.szlcsc.com/datasheet/0402WGF1104TCE/144341.html; Supplier: LCSC; Convert to PCB: yes; Type: 厚膜电阻; Value: 1.1MΩ; Operating Temperature: -55℃~+155℃
R144 = 0402WGF1004TCE: Manufacturer: UNI-ROYAL(厚声); Add into BOM: yes; Tolerance: ±1%; Power(Watts): 62.5mW; Temperature Coefficient: ±100ppm/℃; Overload Voltage (Max): 50V; Description: 电阻类型:厚膜电阻;阻值:1MΩ;精度:±1%;功率:62.5mW;; Name: 1MΩ; Symbol: 0402WGF1004TCE; Device: 0402WGF1004TCE; LCSC Part Name: 1MΩ ±1% 62.5mW; Supplier Part: C26083; Manufacturer Part: 0402WGF1004TCE; Supplier Footprint: 0402; JLCPCB Part Class: 基础库; Datasheet: https://atta.szlcsc.com/upload/public/pdf/source/20200306/C422600_1E6D84923E4A46A82E41ADD87F860B5C.pdf; Supplier: LCSC; Convert to PCB: yes; Type: 厚膜电阻; Value: 1MΩ; Operating Temperature Range: -55℃~+155℃
R145 = 0402WGF2201TCE: Manufacturer: UNI-ROYAL(厚声); Add into BOM: yes; Tolerance: ±1%; Power(Watts): 62.5mW; Voltage-Supply(Max): 50V; Temperature Coefficient: ±100ppm/℃; Description: 电阻类型:厚膜电阻;阻值:2.2kΩ;精度:±1%;功率:62.5mW;工作电压:50V;温度系数:±100ppm/℃;; Name: 2.2kΩ; Symbol: 0402WGF2201TCE; Device: 0402WGF2201TCE; LCSC Part Name: 2.2kΩ ±1% 62.5mW 厚膜电阻; Supplier Part: C25879; Manufacturer Part: 0402WGF2201TCE; Supplier Footprint: 0402; JLCPCB Part Class: 基础库; Datasheet: https://item.szlcsc.com/datasheet/0402WGF2201TCE/26622.html; Supplier: LCSC; Convert to PCB: yes; Type: 厚膜电阻; Value: 2.2kΩ; Operating Temperature: -55℃~+155℃
R146 = 0402WGF3323TCE: Manufacturer: UNI-ROYAL(厚声); Add into BOM: yes; Tolerance: ±1%; Power(Watts): 62.5mW; Voltage-Supply(Max): 50V; Temperature Coefficient: ±100ppm/℃; Description: 电阻类型:厚膜电阻;阻值:332kΩ;精度:±1%;功率:62.5mW;工作电压:50V;温度系数:±100ppm/℃;; Name: 332kΩ; Symbol: 0402WGF3323TCE; Device: 0402WGF3323TCE; LCSC Part Name: 332kΩ ±1% 62.5mW 厚膜电阻; Supplier Part: C44358; Manufacturer Part: 0402WGF3323TCE; Supplier Footprint: 0402; JLCPCB Part Class: 扩展库; Datasheet: https://item.szlcsc.com/datasheet/0402WGF3323TCE/45360.html; Supplier: LCSC; Convert to PCB: yes; Type: 厚膜电阻; Value: 332kΩ; Operating Temperature: -55℃~+155℃
R147 = RC0402FR-07102KL: Manufacturer: YAGEO(国巨); Add into BOM: yes; Tolerance: ±1%; Power(Watts): 62.5mW; Voltage-Supply(Max): 50V; Temperature Coefficient: ±100ppm/℃; Description: 电阻类型:厚膜电阻;阻值:102kΩ;精度:±1%;功率:62.5mW;工作电压:50V;温度系数:±100ppm/℃;; Name: 102kΩ; Symbol: RC0402FR-07102KL; Device: RC0402FR-07102KL; LCSC Part Name: 厚膜电阻 102kΩ ±1% 62.5mW; Supplier Part: C188254; Manufacturer Part: RC0402FR-07102KL; Supplier Footprint: 0402; JLCPCB Part Class: 扩展库; Datasheet: https://item.szlcsc.com/datasheet/RC0402FR-07102KL/199661.html; Supplier: LCSC; Convert to PCB: yes; Type: 厚膜电阻; Value: 102kΩ; Operating Temperature: -55℃~+155℃
R149 R159 = 0402WGF4701TCE: Manufacturer: UNI-ROYAL(厚声); Add into BOM: yes; Tolerance: ±1%; Power(Watts): 62.5mW; Voltage-Supply(Max): 50V; Temperature Coefficient: ±100ppm/℃; Description: 电阻类型:厚膜电阻;阻值:4.7kΩ;精度:±1%;功率:62.5mW;工作电压:50V;温度系数:±100ppm/℃;; Name: 4.7kΩ; Symbol: 0402WGF4701TCE; Device: 0402WGF4701TCE; LCSC Part Name: 4.7kΩ ±1% 62.5mW 厚膜电阻; Supplier Part: C25900; Manufacturer Part: 0402WGF4701TCE; Supplier Footprint: 0402; JLCPCB Part Class: 基础库; Datasheet: https://item.szlcsc.com/datasheet/0402WGF4701TCE/26643.html; Supplier: LCSC; Convert to PCB: yes; Type: 厚膜电阻; Value: 4.7kΩ; Operating Temperature: -55℃~+155℃
R151 = RC0402FR-07511KL: Manufacturer: YAGEO(国巨); Add into BOM: yes; Tolerance: ±1%; Power(Watts): 62.5mW; Overload Voltage (Max): 50V; Temperature Coefficient: ±100ppm/℃; Description: 电阻类型:厚膜电阻;阻值:511kΩ;精度:±1%;功率:62.5mW;最大工作电压:50V;温度系数:±100ppm/℃;; Name: 511kΩ; Symbol: RC0402FR-07511KL; Device: RC0402FR-07511KL; LCSC Part Name: 厚膜电阻 511kΩ ±1% 62.5mW; Supplier Part: C163461; Manufacturer Part: RC0402FR-07511KL; Supplier Footprint: 0402; JLCPCB Part Class: 扩展库; Datasheet: https://atta.szlcsc.com/upload/public/pdf/source/20181009/C309620_DA5935B6E1D48212CB7A533FE518B3C2.pdf; Supplier: LCSC; Convert to PCB: yes; Type: 厚膜电阻; Value: 511kΩ; Operating Temperature Range: -55℃~+155℃
R152 = 0402WGF5112TCE: Manufacturer: UNI-ROYAL(厚声); Add into BOM: yes; Tolerance: ±1%; Power(Watts): 62.5mW; Overload Voltage (Max): 50V; Temperature Coefficient: ±100ppm/℃; Description: 电阻类型:厚膜电阻;阻值:51.1kΩ;精度:±1%;功率:62.5mW;最大工作电压:50V;温度系数:±100ppm/℃;; Name: 51.1kΩ; Symbol: 0402WGF5112TCE; Device: 0402WGF5112TCE; Supplier: LCSC; Manufacturer Part: 0402WGF5112TCE; Supplier Part: C25904; Value: 51.1kΩ; JLCPCB Part Class: 扩展库; LCSC Part Name: 51.1kΩ ±1% 62.5mW 厚膜电阻; Supplier Footprint: 0402; Datasheet: https://atta.szlcsc.com/upload/public/pdf/source/20200306/C422600_1E6D84923E4A46A82E41ADD87F860B5C.pdf; Convert to PCB: yes; Type: 厚膜电阻; Operating Temperature Range: -55℃~+155℃
R153 = 0402WGF2002TCE: Manufacturer: UNI-ROYAL(厚声); Add into BOM: yes; Tolerance: ±1%; Power(Watts): 62.5mW; Overload Voltage (Max): 50V; Temperature Coefficient: ±100ppm/℃; Description: 电阻类型:厚膜电阻;阻值:20kΩ;精度:±1%;功率:62.5mW;最大工作电压:50V;温度系数:±100ppm/℃;; Name: 20kΩ; Symbol: 0402WGF2002TCE; Device: 0402WGF2002TCE; Supplier: LCSC; Manufacturer Part: 0402WGF2002TCE; Supplier Part: C25765; Value: 20kΩ; JLCPCB Part Class: 基础库; LCSC Part Name: 20kΩ ±1% 62.5mW 厚膜电阻; Supplier Footprint: 0402; Datasheet: https://atta.szlcsc.com/upload/public/pdf/source/20200306/C422600_1E6D84923E4A46A82E41ADD87F860B5C.pdf; Convert to PCB: yes; Type: 厚膜电阻; Operating Temperature Range: -55℃~+155℃
R154 = 0402WGF4022TCE: Manufacturer: UNI-ROYAL(厚声); Add into BOM: yes; Tolerance: ±1%; Power(Watts): 62.5mW; Overload Voltage (Max): 50V; Temperature Coefficient: ±100ppm/℃; Description: 电阻类型:厚膜电阻;阻值:40.2kΩ;精度:±1%;功率:62.5mW;最大工作电压:50V;温度系数:±100ppm/℃;; Name: 47kΩ; Symbol: 0402WGF4022TCE; Device: 0402WGF4022TCE; Supplier: LCSC; Manufacturer Part: 0402WGF4022TCE; Supplier Part: C25893; Value: 47kΩ; JLCPCB Part Class: 扩展库; LCSC Part Name: 40.2kΩ ±1% 62.5mW 厚膜电阻; Supplier Footprint: 0402; Datasheet: https://atta.szlcsc.com/upload/public/pdf/source/20200306/C422600_1E6D84923E4A46A82E41ADD87F860B5C.pdf; Convert to PCB: yes; Type: 厚膜电阻; Operating Temperature Range: -55℃~+155℃
R155 = 0402WGF6651TCE: Manufacturer: UNI-ROYAL(厚声); Add into BOM: yes; Tolerance: ±1%; Power(Watts): 62.5mW; Overload Voltage (Max): 50V; Temperature Coefficient: ±100ppm/℃; Description: 电阻类型:厚膜电阻;阻值:6.65kΩ;精度:±1%;功率:62.5mW;最大工作电压:50V;温度系数:±100ppm/℃;; Name: 6.65kΩ; Symbol: 0402WGF6651TCE; Device: 0402WGF6651TCE; Supplier: LCSC; Manufacturer Part: 0402WGF6651TCE; Supplier Part: C45194; Value: 6.65kΩ; JLCPCB Part Class: 扩展库; LCSC Part Name: 6.65kΩ ±1% 62.5mW 厚膜电阻; Supplier Footprint: 0402; Datasheet: https://atta.szlcsc.com/upload/public/pdf/source/20200306/C422600_1E6D84923E4A46A82E41ADD87F860B5C.pdf; Convert to PCB: yes; Type: 厚膜电阻; Operating Temperature Range: -55℃~+155℃
R156 = 0402WGF6041TCE: Manufacturer: UNI-ROYAL(厚声); Add into BOM: yes; Tolerance: ±1%; Power(Watts): 62.5mW; Overload Voltage (Max): 50V; Temperature Coefficient: ±100ppm/℃; Description: 电阻类型:厚膜电阻;阻值:6.04kΩ;精度:±1%;功率:62.5mW;最大工作电压:50V;温度系数:±100ppm/℃;; Name: 7.5kΩ; Symbol: 0402WGF6041TCE; Device: 0402WGF6041TCE; Supplier: LCSC; Manufacturer Part: 0402WGF6041TCE; Supplier Part: C25913; Value: 7.5kΩ; JLCPCB Part Class: 扩展库; LCSC Part Name: 6.04kΩ ±1% 62.5mW 厚膜电阻; Supplier Footprint: 0402; Datasheet: https://atta.szlcsc.com/upload/public/pdf/source/20200306/C422600_1E6D84923E4A46A82E41ADD87F860B5C.pdf; Convert to PCB: yes; Type: 厚膜电阻; Operating Temperature Range: -55℃~+155℃
R160 = 0402WGF7501TCE: Manufacturer: UNI-ROYAL(厚声); Add into BOM: yes; Tolerance: ±1%; Power(Watts): 62.5mW; Overload Voltage (Max): 50V; Temperature Coefficient: ±100ppm/℃; Description: 电阻类型:厚膜电阻;阻值:7.5kΩ;精度:±1%;功率:62.5mW;最大工作电压:50V;温度系数:±100ppm/℃;; Name: 7.5kΩ; Symbol: 0402WGF7501TCE; Device: 0402WGF7501TCE; LCSC Part Name: 7.5kΩ ±1% 62.5mW 厚膜电阻; Supplier Part: C25918; Manufacturer Part: 0402WGF7501TCE; Supplier Footprint: 0402; JLCPCB Part Class: 扩展库; Datasheet: https://atta.szlcsc.com/upload/public/pdf/source/20200306/C422600_1E6D84923E4A46A82E41ADD87F860B5C.pdf; Supplier: LCSC; Convert to PCB: yes; Type: 厚膜电阻; Value: 7.5kΩ; Operating Temperature Range: -55℃~+155℃
R161 = 0402WGF3322TCE: Manufacturer: UNI-ROYAL(厚声); Add into BOM: yes; Tolerance: ±1%; Power(Watts): 62.5mW; Voltage-Supply(Max): 50V; Temperature Coefficient: ±100ppm/℃; Description: 电阻类型:厚膜电阻;阻值:33.2kΩ;精度:±1%;功率:62.5mW;工作电压:50V;温度系数:±100ppm/℃;; Name: 33.2kΩ; Symbol: 0402WGF3322TCE; Device: 0402WGF3322TCE; LCSC Part Name: 33.2kΩ ±1% 62.5mW 厚膜电阻; Supplier Part: C122548; Manufacturer Part: 0402WGF3322TCE; Supplier Footprint: 0402; JLCPCB Part Class: 扩展库; Datasheet: https://item.szlcsc.com/datasheet/0402WGF3322TCE/123817.html; Supplier: LCSC; Convert to PCB: yes; Type: 厚膜电阻; Value: 33.2kΩ; Operating Temperature: -55℃~+155℃
SW2 = SS-12D10L5: Manufacturer: XKB Connection(中国星坤); Add into BOM: yes; Circuit: 单刀双掷; Actuator Style: 矩形柱状; Switch Height: 6.4mm; Actuator Color: 黑色; Current Rating: 3A; Voltage Rating: 125V; Life: 1万次; Description: 电路结构:单刀双掷;安装方式:直插;开关颜色:黑色;额定电流:3A;额定电压:125V;工作寿命:1万次;; Name: SS-12D10L5; Symbol: SS-12D10L5; Device: SS-12D10L5; LCSC Part Name: 柄长5mm 直插双档 滑动开关; Supplier Part: C319012; Manufacturer Part: SS-12D10L5; Supplier Footprint: 插件,13x6.8mm; JLCPCB Part Class: 扩展库; Datasheet: https://item.szlcsc.com/datasheet/SS-12D10L5/300104.html; Supplier: LCSC; Convert to PCB: yes; Termination Style: PC引脚; Length: 13mm; Width: 6.8mm; Mounting Type: 直插; Operating Temperature: -40℃~+85℃
U31-U33 U45 U47 = TPS82130SILR: Manufacturer: TI(德州仪器); Add into BOM: yes; Output Channel: 1; Input Voltage(DC): 3V~17V; Output Voltage: 900mV~6V; Output Current (Max): 3A; Description: 输入电压(DC):3V~17V;输出电压:900mV~6V;输出电流(最大值):3A;; Name: TPS82130SILR; Symbol: TPS82130SILR; Device: TPS82130SILR; Supplier: LCSC; Supplier Part: C473914; Manufacturer Part: TPS82130SILR; JLCPCB Part Class: 扩展库; LCSC Part Name: TPS82130SILR; Supplier Footprint: USIP-8; Datasheet: https://www.ti.com/cn/lit/gpn/tps82130; Convert to PCB: yes; Function: -
U34 = ADP5074ACPZ-R7: Manufacturer: ADI(亚德诺); Add into BOM: yes; Output Type: 可调; Input Voltage: 2.85V~15V; Number of Outputs: 1; Topology: 反相式; Description: 功能类型:-;输出类型:可调;工作电压:2.85V~15V;输出电压:-;输出电流:-;; Name: ADP5074ACPZ-R7; Symbol: ADP5074ACPZ-R7; Device: ADP5074ACPZ-R7; LCSC Part Name: 2.4 A 反相DC-DC调节器; Supplier Part: C659272; Manufacturer Part: ADP5074ACPZ-R7; Supplier Footprint: LFCSP-16(3x3); JLCPCB Part Class: 扩展库; Datasheet: https://atta.szlcsc.com/upload/public/pdf/source/20200728/C659272_DB401E8FA3347C8C1A03DD4B016E5993.pdf; Supplier: LCSC; Convert to PCB: yes; Function: -; Output Voltage: -; Output Current: -; Switching Frequency: -; Operating Temperature: -40℃~+125℃; Synchronous Rectification: -; Quiescent Current (Iq): -; Switch tube (built-in/external): -
U35 = DFLS240L: Manufacturer: FUXINSEMI(富芯森美); Add into BOM: yes; Diode Configuration: 独立式; Voltage - Forward(Vf@If): 500mV@2A; Voltage - DC Reverse(Vr): 40V; Current - Rectified: 2A; Reverse Leakage Current (Ir): 100uA@40V; Operating Junction Temperature Range: -55℃~+125℃; Non-Repetitive Peak Forward Surge Current: 50A; Description: 二极管配置:独立式;正向压降(Vf):500mV@2A;直流反向耐压(Vr):40V;整流电流:2A;; Name: DFLS240L; Symbol: DFLS240L; Device: DFLS240L; LCSC Part Name: 电压:40V 电流:2A; Supplier Part: C5380706; Manufacturer Part: DFLS240L; Supplier Footprint: PowerDI-123; JLCPCB Part Class: 扩展库; Datasheet: https://item.szlcsc.com/datasheet/DFLS240L/6248470.html; Supplier: LCSC; Convert to PCB: yes
U36 = XAL4020-222MEC: Manufacturer: Coilcraft(线艺); Add into BOM: yes; Name: XAL4020-222MEC; Symbol: XAL4020-222MEC; Device: XAL4020-222MEC; LCSC Part Name: XAL4020-222MEC; Supplier Part: C3151182; Manufacturer Part: XAL4020-222MEC; Supplier Footprint: SMD,4x4mm; JLCPCB Part Class: 扩展库; Datasheet: https://atta.szlcsc.com/upload/public/pdf/source/20231110/85A078131A04A3080D8D7E0D07D6A26C.pdf; Supplier: LCSC; Convert to PCB: yes
U37 U38 U42 U43 = TPS7A8300ARGWR: Manufacturer: TI(德州仪器); Add into BOM: yes; Output Type: 可调; Maximum Input Voltage: 6.5V; Output Voltage: 800mV~5.2V; Output Current: 2A; Dropout Voltage: 300mV@(2A); standby current: 4mA; Output Polarity: 正极; Number of Outputs: 1; Description: 输出类型:可调;工作电压:6.5V;输出电压:800mV~5.2V;输出电流:2A;电源纹波抑制比(PSRR):-;输出极性:正极;; Name: TPS7A8300ARGWR; Symbol: TPS7A8300ARGWR; Device: TPS7A8300ARGWR; LCSC Part Name: 具有电源正常指示功能的 2A、低输入电压 (1.1V)、低噪声、高精度、超低压降稳压器; Supplier Part: C2860640; Manufacturer Part: TPS7A8300ARGWR; Supplier Footprint: VQFN-20(5x5); JLCPCB Part Class: 扩展库; Datasheet: https://www.ti.com/cn/lit/gpn/tps7a83a; Supplier: LCSC; Convert to PCB: yes; Power Supply Rejection Ratio (PSRR): -; Noise: -; Feature: 防静电保护；浪涌保护；低ESR；热保护(TSD)；欠压闭锁；过流保护(OCP)；带使能；防倒灌; Operating Temperature: -40℃~+125℃@(Tj)
U39 = TPS7A4701MRGWREP: Manufacturer: TI(德州仪器); Add into BOM: yes; Description: 36V、1A、4μVRMS、射频 LDO 稳压器 20-VQFN -55 to 125; Name: TPS7A4701MRGWREP; Symbol: TPS7A4701MRGWREP; Device: TPS7A4701MRGWREP; LCSC Part Name: 增强型产品，36V，1A，4uVRMS，RF LDO 电压调节器; Supplier Part: C2872670; Manufacturer Part: TPS7A4701MRGWREP; Supplier Footprint: VQFN-20-EP(5x5); JLCPCB Part Class: 扩展库; Datasheet: https://www.ti.com/cn/lit/gpn/tps7a4701-ep; Supplier: LCSC; Convert to PCB: yes
U40 = TPS7A3301RGWR: Manufacturer: TI(德州仪器); Add into BOM: yes; Output Type: 可调; Maximum Input Voltage: 36V; Output Voltage: 1.18V~33V; MAX Output Current: 1A; Power Supply Rejection Ratio (PSRR): 72dB@(10kHz); Dropout Voltage: 800mV@(1A); Output Polarity: 负极; Number of Outputs: 1; Description: 输出类型:可调;最大输入电压:36V;输出电压:1.18V~33V;最大输出电流:1A;电源纹波抑制比(PSRR):72dB@(10kHz);输出极性:负极;; Name: TPS7A3301RGWR; Symbol: TPS7A3301RGWR; Device: TPS7A3301RGWR; Supplier: LCSC; Supplier Part: C90082; Manufacturer Part: TPS7A3301RGWR; JLCPCB Part Class: 扩展库; LCSC Part Name: ADJ 输入36V 输出1.18V~33V 1A; Supplier Footprint: VQFN-20-EP(5x5); Datasheet: https://www.ti.com/cn/lit/gpn/tps7a33; Convert to PCB: yes
U41 = SPX3819M5-L-5-0/TR: 输出类型:固定;最大输入电压:16V;输出电压:5V;最大输出电流:500mA;电源纹波抑制比(PSRR):-;输出极性:正极;; Manufacturer: MaxLinear(迈凌); Add into BOM: yes; Output Type: 固定; Voltage - Supply: 16V; Output Voltage: 5V; Output Current: 500mA; Voltage Dropout: 340mV@(500mA); standby current: 8uA; Noise: 40uVrms; Output Configuration: 正极; Number of Outputs: 1; Dropout Voltage: 700mV@(500mA); Name: SPX3819M5-L-5-0/TR; Symbol: SPX3819M5-L-5-0/TR; Device: SPX3819M5-L-5-0/TR; LCSC Part Name: 输入16V 输出5V 500mA; Supplier Part: C13417; Manufacturer Part: SPX3819M5-L-5-0/TR; Supplier Footprint: SOT-23-5; JLCPCB Part Class: 扩展库; Datasheet: https://atta.szlcsc.com/upload/public/pdf/source/20150720/1457707331934.pdf; Supplier: LCSC; Convert to PCB: yes; Power Supply Rejection Ratio (PSRR): -; Features: 带使能；过热保护；过流保护; Operating Temperature: -40℃~+125℃; Maximum Input Voltage: 16V; MAX Output Current: 500mA; Output Polarity: 正极
U44 = TPS7A2033PDBVR: Manufacturer: TI(德州仪器); Add into BOM: yes; Name: TPS7A2033PDBVR; Symbol: TPS7A2033PDBVR; Device: TPS7A2033PDBVR; LCSC Part Name: TPS7A2033PDBVR; Supplier Part: C2862740; Manufacturer Part: TPS7A2033PDBVR; Supplier Footprint: SOT-23-5; JLCPCB Part Class: 扩展库; Datasheet: https://atta.szlcsc.com/upload/public/pdf/source/20230221/9B73099824E408F4B24BD95C528A27ED.pdf; Supplier: LCSC; Convert to PCB: yes
U46 = TPS16630RGER: Manufacturer: TI(德州仪器); Add into BOM: yes; Voltage Rating: 4.5V~60V; Description: 额定电压:4.5V~60V;; Name: TPS16630RGER; Symbol: TPS16630RGER; Device: TPS16630RGER; LCSC Part Name: TPS16630RGER; Supplier Part: C1850279; Manufacturer Part: TPS16630RGER; Supplier Footprint: VQFN-24(4x4); JLCPCB Part Class: 扩展库; Datasheet: https://www.ti.com/cn/lit/gpn/tps1663; Supplier: LCSC; Convert to PCB: yes; Operating temperature: -40℃~+125℃@(Tj)
U48 = NCD0603R6: Manufacturer: 国星光电; Add into BOM: yes; Emitted Color: 红色; Forward Voltage (VF): 1.6V~2.4V; Power Dissipation: 65mW; Forward Current: 25mA; Dominant Wavelength: 620nm~630nm; Peak Wavelength: 630nm; Lens Color: 无色透明透镜; Luminous Intensity: 30mcd~80mcd; Viewing Angle: 140°; Description: 发光颜色:红色;正向电压(VF):1.6V~2.4V;功率:65mW;正向电流:25mA;主波长:620nm~630nm;透镜颜色:无色透明透镜;发光强度:30mcd~80mcd;发光角度:140°;工作温度:-30℃~+85℃;; Name: NCD0603R6; Symbol: NCD0603R6; Device: NCD0603R6; LCSC Part Name: NCD0603R6; Supplier Part: C7429910; Manufacturer Part: NCD0603R6; Supplier Footprint: 0603; JLCPCB Part Class: 扩展库; Datasheet: https://atta.szlcsc.com/upload/public/pdf/source/20230620/13EAC00507632A35BC4A697CF03A06D7.pdf; Supplier: LCSC; Convert to PCB: yes; Operating Temperature: -30℃~+85℃
U59 = LT3094IDD#TRPBF: Manufacturer: ADI(亚德诺); Add into BOM: yes; Output Type: 可调; Voltage - Supply: 20V; Output Voltage: 0V~19.5V; Output Current: 500mA; Power Supply Rejection Ratio (PSRR): 74dB@(1MHz); Voltage Dropout: 235mV@(500mA); standby current: 2.35mA; Noise: 0.8uVrms; Output Configuration: 负极; Number of Outputs: 1; Description: 输出类型:可调;工作电压:20V;输出电压:0V~19.5V;输出电流:500mA;电源纹波抑制比(PSRR):74dB@(1MHz);输出极性:负极;; Name: LT3094IDD#TRPBF; Symbol: LT3094IDD#TRPBF; Device: LT3094IDD#TRPBF; LCSC Part Name: -20V、500mA、超低噪声、超高 PSRR 负线性稳压器; Supplier Part: C670499; Manufacturer Part: LT3094IDD#TRPBF; Supplier Footprint: DFN-12-EP(3x3); JLCPCB Part Class: 扩展库; Datasheet: https://item.szlcsc.com/datasheet/LT3094IDD%2523TRPBF/701590.html; Supplier: LCSC; Convert to PCB: yes; Features: PG脚；过热保护；过流保护；带使能; Operating Temperature: -40℃~+125℃